# EAGLE design Energy-Monitor-FeatherWing-ATSAMD21 (EAGLE 7.6.0)
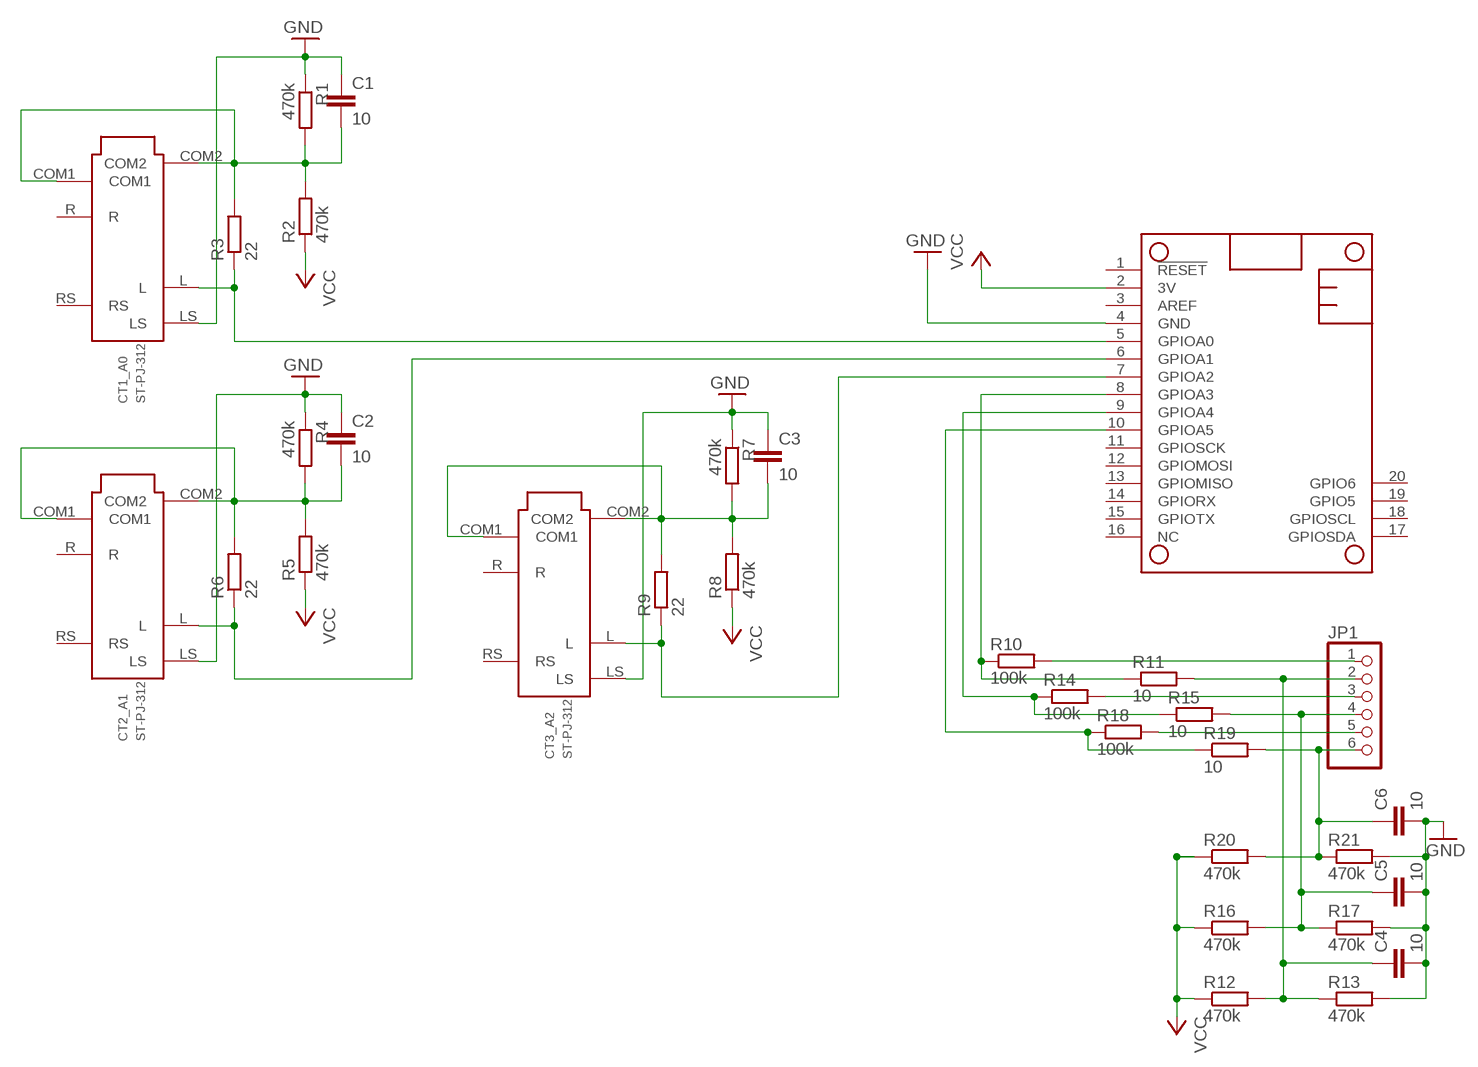
[diagram p0: schematic, sheet 1]

## Parts
C1  10  C-EUC0402  [C0402]
C2  10  C-EUC0402  [C0402]
C3  10  C-EUC0402  [C0402]
C4  10  C-EUC0402  [C0402]
C5  10  C-EUC0402  [C0402]
C6  10  C-EUC0402  [C0402]
CT1_A0  ST-PJ-312  [SUNTECH_ST-PJ-312]
CT2_A1  ST-PJ-312  [SUNTECH_ST-PJ-312]
CT3_A2  ST-PJ-312  [SUNTECH_ST-PJ-312]
JP1  PINHD-1X6CB  [1X06-CLEANBIG]
MS1  FEATHERWING  [FEATHERWING]
R1  470k  R-EU_R0402  [R0402]
R2  470k  R-EU_R0402  [R0402]
R3  22  R-EU_R0402  [R0402]
R4  470k  R-EU_R0402  [R0402]
R5  470k  R-EU_R0402  [R0402]
R6  22  R-EU_R0402  [R0402]
R7  470k  R-EU_R0402  [R0402]
R8  470k  R-EU_R0402  [R0402]
R9  22  R-EU_R0402  [R0402]
R10  100k  R-EU_R0402  [R0402]
R11  10  R-EU_R0402  [R0402]
R12  470k  R-EU_R0402  [R0402]
R13  470k  R-EU_R0402  [R0402]
R14  100k  R-EU_R0402  [R0402]
R15  10  R-EU_R0402  [R0402]
R16  470k  R-EU_R0402  [R0402]
R17  470k  R-EU_R0402  [R0402]
R18  100k  R-EU_R0402  [R0402]
R19  10  R-EU_R0402  [R0402]
R20  470k  R-EU_R0402  [R0402]
R21  470k  R-EU_R0402  [R0402]

## Nets
AC_GND: C6.1 JP1.6 R19.2 R20.2 R21.1
CT1_REF: C1.2 CT1_A0.COM1 CT1_A0.COM2 R1.2 R2.2 R3.2
CT2_REF: C2.2 CT2_A1.COM1 CT2_A1.COM2 R4.2 R5.2 R6.2
CT3_REF: C3.2 CT3_A2.COM1 CT3_A2.COM2 R7.2 R8.2 R9.2
GND: C1.1 C2.1 C3.1 C4.2 C5.2 C6.2 CT1_A0.LS CT2_A1.LS CT3_A2.LS MS1.4(GND) R1.1 R4.1 R7.1 R13.2 R17.2 R21.2
N$1: CT1_A0.L MS1.5(GPIOA0) R3.1
N$2: CT2_A1.L MS1.6(GPIOA1) R6.1
N$3: CT3_A2.L MS1.7(GPIOA2) R9.1
N$4: JP1.1 R10.2
N$5: MS1.8(GPIOA3) R10.1 R11.1
N$6: C5.1 JP1.4 R15.2 R16.2 R17.1
N$7: JP1.3 R14.2
N$8: MS1.9(GPIOA4) R14.1 R15.1
N$9: C4.1 JP1.2 R11.2 R12.2 R13.1
N$10: JP1.5 R18.2
N$11: MS1.10(GPIOA5) R18.1 R19.1
VCC: MS1.2(3V) R2.1 R5.1 R8.1 R12.1 R16.1 R20.1
Unconnected: CT1_A0.R CT1_A0.RS CT2_A1.R CT2_A1.RS CT3_A2.R CT3_A2.RS MS1.1(!RESET) MS1.3(AREF) MS1.11(GPIOSCK) MS1.12(GPIOMOSI) MS1.13(GPIOMISO) MS1.14(GPIORX) MS1.15(GPIOTX) MS1.16(NC) MS1.17(GPIOSDA) MS1.18(GPIOSCL) MS1.19(GPIO5) MS1.20(GPIO6)

## Library data of the parts
C1-C6 = resistor:C-EU: CAPACITOR, European symbol
CT1_A0 CT2_A1 CT3_A2 = ST-PJ-312:ST-PJ-312: SMD Audio Jack; 3.5mm
JP1 = adafruit:PINHD-1X6: PIN HEADER
MS1 = adafruit:FEATHERWING
R1-R21 = resistor:R-EU_: RESISTOR, European symbol

## Board
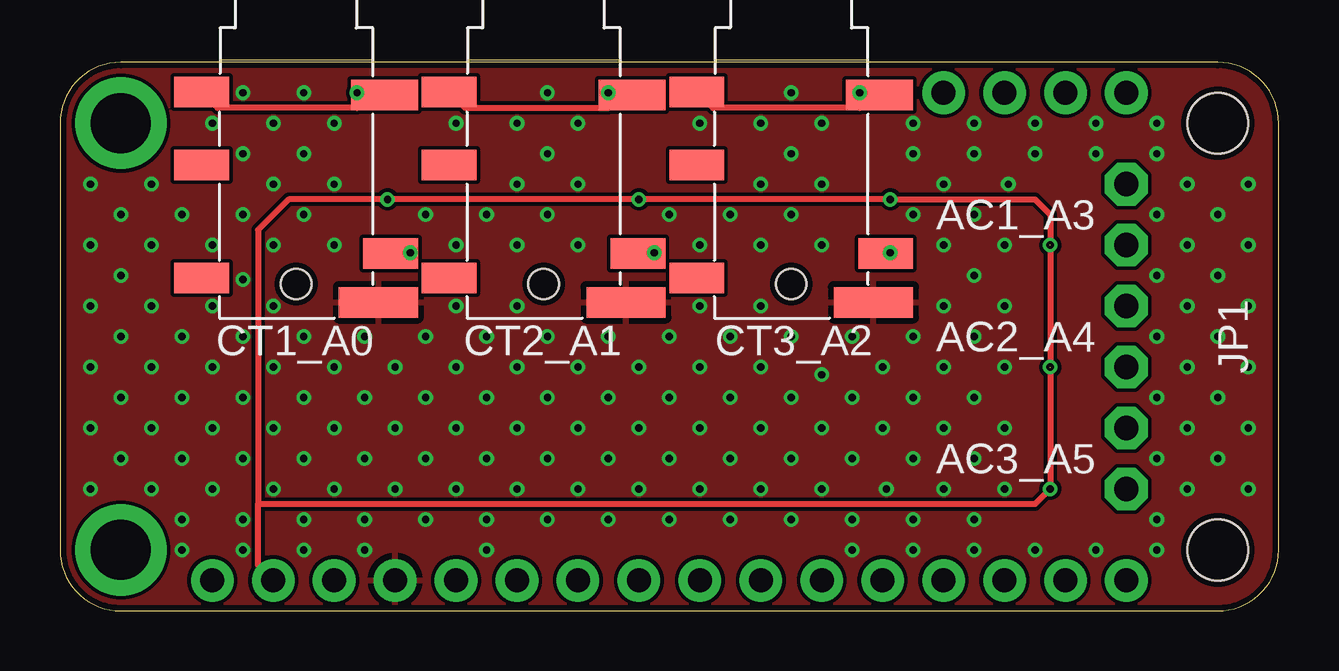
[diagram p1: board, top side]
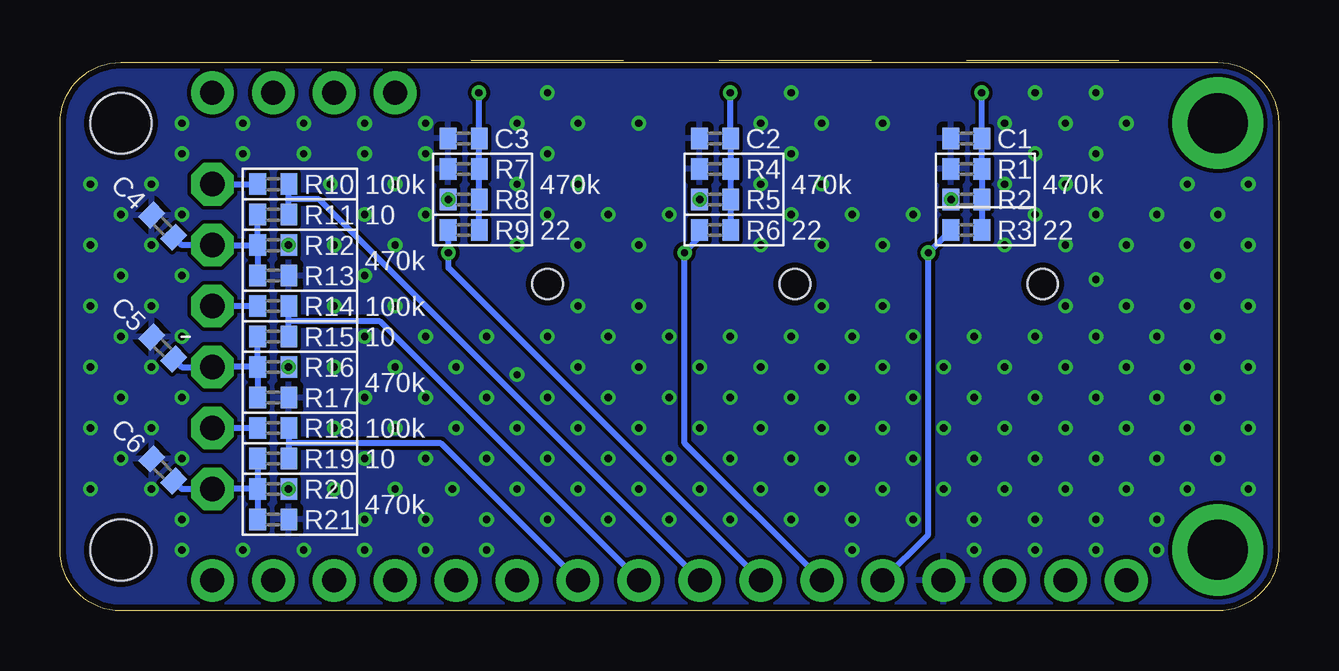
[diagram p2: board, bottom side, seen from below]

Size 50.8 x 22.95 mm. Coordinates in mm from the lower left corner, seen from the top.
Copper layers (1*16): Top 0.035mm / dielectric 1.5mm / Bottom 0.035mm
Design rules "SeeedStudio_2layer_DRU_no_angle_20140221": minimum track width 6mil, minimum drill 12mil, track to track 6mil, track to pad 6mil, pad to pad 6mil, via to via 6mil, smd to smd 0mil, copper to edge 10mil, drill to drill 10mil, minimum pad ring 10mil, minimum via ring 6mil, stop-mask expansion 2mil, vias tented up to drill 100mil, thermal gap 10mil

### Footprints (pad centres in the part's own frame; a part is rotated, then mirrored left to right if it is on the bottom)
C0402 = smd 0.7 x 0.9: 1 -0.65,0; 2 0.65,0
SUNTECH_ST-PJ-312 = smd 1.27 x 2.286: COM1 3.048,3.937; L -3.683,-3.937; R 0,3.937; RS -4.699,3.937 | smd 1.27 x 2.794: COM2 2.921,-3.683 | smd 1.27 x 3.302: LS -5.715,-3.429 | hole 1.27: -4.953,0
1X06-CLEANBIG = drill 1.016 pad 1.778 octagon: 1 -6.35,0; 2 -3.81,0; 3 -1.27,0; 4 1.27,0; 5 3.81,0; 6 6.35,0
FEATHERWING = drill 1 pad 1.778: 1 6.35,1.27; 2 8.89,1.27; 3 11.43,1.27; 4 13.97,1.27; 5 16.51,1.27; 6 19.05,1.27; 7 21.59,1.27; 8 24.13,1.27; 9 26.67,1.27; 10 29.21,1.27; 11 31.75,1.27; 12 34.29,1.27; 13 36.83,1.27; 14 39.37,1.27; 15 41.91,1.27; 16 44.45,1.27; 17 44.45,21.59; 18 41.91,21.59; 19 39.37,21.59; 20 36.83,21.59 | drill 2.5 pad 3.81: P$1 2.54,20.32; P$2 2.54,2.54 | hole 2.54: 48.26,20.32; 48.26,2.54
R0402 = smd 0.7 x 0.9: 1 -0.65,0; 2 0.65,0

### Placement (x,y rotation side)
C1  13.02,19.68 0 bottom
C2  23.5,19.68 0 bottom
C3  33.97,19.68 0 bottom
C4  46.51,16.03 135 bottom
C5  46.51,10.95 135 bottom
C6  46.51,5.87 135 bottom
CT1_A0  9.84,18.57 90 top
CT2_A1  20.16,18.57 90 top
CT3_A2  30.48,18.57 90 top
JP1  44.45,11.43 270 top
MS1  0,0 0 top
R1  13.02,18.41 0 bottom
R2  13.02,17.14 0 bottom
R3  13.02,15.88 0 bottom
R4  23.5,18.41 0 bottom
R5  23.5,17.14 0 bottom
R6  23.5,15.88 0 bottom
R7  33.97,18.41 0 bottom
R8  33.97,17.14 0 bottom
R9  33.97,15.88 0 bottom
R10  41.91,17.78 180 bottom
R11  41.91,16.51 180 bottom
R12  41.91,15.24 180 bottom
R13  41.91,13.97 0 bottom
R14  41.91,12.7 180 bottom
R15  41.91,11.43 180 bottom
R16  41.91,10.16 180 bottom
R17  41.91,8.89 0 bottom
R18  41.91,7.62 180 bottom
R19  41.91,6.35 180 bottom
R20  41.91,5.08 180 bottom
R21  41.91,3.81 0 bottom

### Tracks (layer width: path | path; a pad name or v marks a point on that pad's centre or on a via)
AC_GND
  Bottom 0.254: R19.2 R20.2 | R20.2 R21.1 | R20.2 JP1.6 45.72,5.08 C6.1
CT1_REF  (via drill 0.3 pad 0.61)
  Top 0.254: CT1_A0.COM2 v12.38,21.59 12.38,20.95 6.57,20.95 CT1_A0.COM1
  Bottom 0.254: R3.2 R2.2 R1.2 C1.2 12.37,21.59 v12.38,21.59
CT2_REF  (via drill 0.3 pad 0.61)
  Top 0.254: v22.86,21.59 23.5,21.65 CT2_A1.COM2 | 22.86,20.95 v22.86,21.59 | CT2_A1.COM1 16.89,20.95 22.84,20.95 22.86,20.97 v22.86,21.59
  Bottom 0.254: R6.2 R5.2 R4.2 C2.2 22.84,21.59 v22.86,21.59
CT3_REF  (via drill 0.3)
  Top 0.254: 26.54,21.97 CT3_A2.COM1 27.21,20.95 33.34,20.95 v33.34,21.59 CT3_A2.COM2
  Bottom 0.254: R9.2 R8.2 R7.2 C3.2 33.32,21.59 v33.34,21.59
GND  (via drill 0.3 pad 0.61)
  other vias: 1.27,17.78 2.54,16.51 3.81,17.78 2.54,13.97 1.27,15.24 1.27,12.7 2.54,11.43 3.81,7.62 5.08,11.43 5.08,8.89 2.54,6.35 2.54,8.89 1.27,10.16 1.27,7.62 1.27,5.08 3.81,5.08 5.08,3.81 5.08,6.35 3.81,12.7 5.08,16.51 6.35,7.62 6.35,10.16 11.43,15.24 10.16,11.43 11.43,20.32 10.16,19.05 8.89,20.32 7.62,19.05 6.35,20.32 7.62,8.89 7.62,11.43 30.48,19.05 35.56,19.05 27.94,11.43 11.43,10.16 10.16,8.89 8.89,15.24 10.16,16.51 7.62,6.35 3.81,15.24 6.35,5.08 7.62,3.81 35.56,3.81 38.1,3.81 45.72,8.89 38.1,8.89 48.26,8.89 48.26,11.43 48.26,13.97 48.26,16.51 49.53,17.78 45.72,19.05 38.1,19.05 40.64,19.05 38.1,16.51 46.99,17.78 46.99,12.7 3.81,10.16 43.18,19.05 6.35,15.24 11.43,7.62 10.16,6.35 10.16,3.81 12.7,3.81 12.7,6.35 12.7,8.89 12.7,11.43 15.24,11.43 16.51,10.16 15.24,6.35 17.78,6.35 20.32,6.35 22.86,6.35 25.4,6.35 27.94,6.35 30.48,6.35 33.02,6.35 16.51,7.62 19.05,7.62 21.59,7.62 26.67,7.62 29.21,7.62 31.75,7.62 34.29,7.62 36.83,7.62 35.56,8.89 30.48,3.81 27.94,3.81 33.02,3.81 25.4,3.81 22.86,3.81 20.32,3.81 17.78,3.81 15.24,3.81 15.24,8.89 17.78,8.89 20.32,8.89 22.86,8.89 25.4,8.89 27.94,8.89 30.48,8.89 33.02,8.89 19.05,10.16 21.59,10.16 26.67,10.16 29.21,10.16 31.75,9.84 33.02,11.43 34.29,10.16 35.56,11.43 36.83,12.7 38.1,13.97 36.83,15.24 16.51,12.7 17.78,11.43 20.32,11.43 19.05,12.7 22.86,11.43 25.4,11.43 26.67,12.7 30.48,11.43 29.21,12.7 29.21,15.24 31.75,15.24 30.48,16.51 19.05,15.24 20.32,16.51 21.59,15.24 17.78,16.51 15.24,16.51 16.51,15.24 19.05,20.32 20.32,19.05 21.59,20.32 26.67,20.32 29.21,20.32 31.75,20.32 16.51,20.32 20.32,21.59 10.16,21.59 7.62,21.59 30.48,21.59 36.83,10.16 49.53,15.24 49.53,12.7 49.53,10.16 49.53,7.62 49.53,5.08 48.26,6.35 45.72,6.35 45.72,3.81 46.99,7.62 45.72,16.51 45.72,13.97 45.72,11.43 27.94,16.51 26.67,15.24 25.4,16.51 39.37,15.24 39.37,12.7 39.37,10.16 38.1,11.43 11.43,5.08 16.51,5.08 19.05,5.08 21.59,5.08 24.13,5.08 26.67,5.08 29.21,5.08 31.75,5.08 34.45,5.08 36.83,5.08 35.56,6.35 38.1,6.35 39.37,7.62 39.37,5.08 8.89,7.62 8.89,10.16 8.89,5.08 7.62,13.81 6.35,12.7 8.89,12.7 7.62,16.51 8.89,17.78 11.43,17.78 19.05,17.78 21.59,17.78 29.21,17.78 31.75,17.78 36.83,17.78 39.53,17.78 35.56,16.51 13.97,10.16 13.97,7.62 13.97,5.08 24.13,10.16 24.13,7.62 46.99,15.24 46.99,10.16 46.99,5.08 40.64,2.54 43.18,2.54 38.1,2.54 35.56,2.54 33.02,2.54 45.72,2.54 17.78,2.54 12.7,2.54 10.16,2.54 7.62,2.54 5.08,2.54 38.1,20.32 35.56,20.32 40.64,20.32 43.18,20.32 45.72,20.32
  pour Bottom: 48.26,0 2.54,0 arc-90 0,2.54 0,20.32 arc-90 2.54,22.86 48.26,22.86 arc-90 50.8,20.32 50.8,2.54 arc-90
  pour Top: 48.26,0 2.54,0 arc-90 0,2.54 0,20.32 arc-90 2.54,22.86 48.26,22.86 arc-90 50.8,20.32 50.8,2.54 arc-90
N$1  (via drill 0.3 pad 0.61)
  Top 0.254: CT1_A0.L 13.46,14.92 v14.61,14.92
  Bottom 0.254: R3.1 13.65,15.88 v14.61,14.92 14.61,3.17 MS1.5
N$2  (via drill 0.3 pad 0.61)
  Top 0.254: v24.77,14.92 CT2_A1.L
  Bottom 0.254: R6.1 24.14,15.57 v24.77,14.92 24.77,6.99 MS1.6
N$3  (via drill 0.3)
  Top 0.254: v34.61,14.92 CT3_A2.L
  Bottom 0.254: R9.1 34.61,14.91 v34.61,14.92 34.61,14.29 MS1.7
N$4
  Bottom 0.254: JP1.1 R10.2
N$5
  Bottom 0.254: MS1.8 40.01,17.14 41.26,17.14 | R11.1 41.26,17.14 | 41.26,17.14 R10.1
N$6
  Bottom 0.254: 42.56,10.18 42.55,10.16 R16.2 R17.1 | 42.56,10.18 R15.2 | 42.56,10.18 44.44,10.18 JP1.4 45.72,10.16 C5.1
N$7
  Bottom 0.254: R14.2 JP1.3
N$8
  Bottom 0.254: MS1.9 37.47,12.06 41.26,12.06 | R15.1 41.26,12.06 | 41.26,12.06 R14.1
N$9
  Bottom 0.254: R12.2 JP1.2 45.72,15.24 C4.1 | R12.2 R11.2 | R12.2 R13.1
N$10
  Bottom 0.254: R18.2 JP1.5
N$11
  Bottom 0.254: MS1.10 34.92,6.99 41.26,6.99 | R18.1 41.26,6.99 | 41.26,6.99 R19.1
VCC  (via drill 0.3, 0.3 pad 0.61)  (2 unrouted)
  Top 0.254: 8.26,4.45 40.64,4.45 v41.27,5.08 v41.27,10.16 v41.27,15.24 41.27,16.51 40.64,17.14 v34.61,17.14 v24.13,17.14 v13.65,17.14 9.53,17.14 8.26,15.88 8.26,4.45 | MS1.2 8.26,1.91 8.26,4.45
  Bottom 0.254: v13.65,17.14 R2.1 | v24.13,17.14 R5.1 | R8.1 v34.61,17.14 | R20.1 v41.27,5.08

### Text on the board
tNames: AC1_A3 | AC2_A4 | AC3_A5
bNames: 470k | 470k | 470k | 100k | 10 | 22 | 22 | 22 | 470k | 100k | 10 | 470k | 100k | 10 | 470k